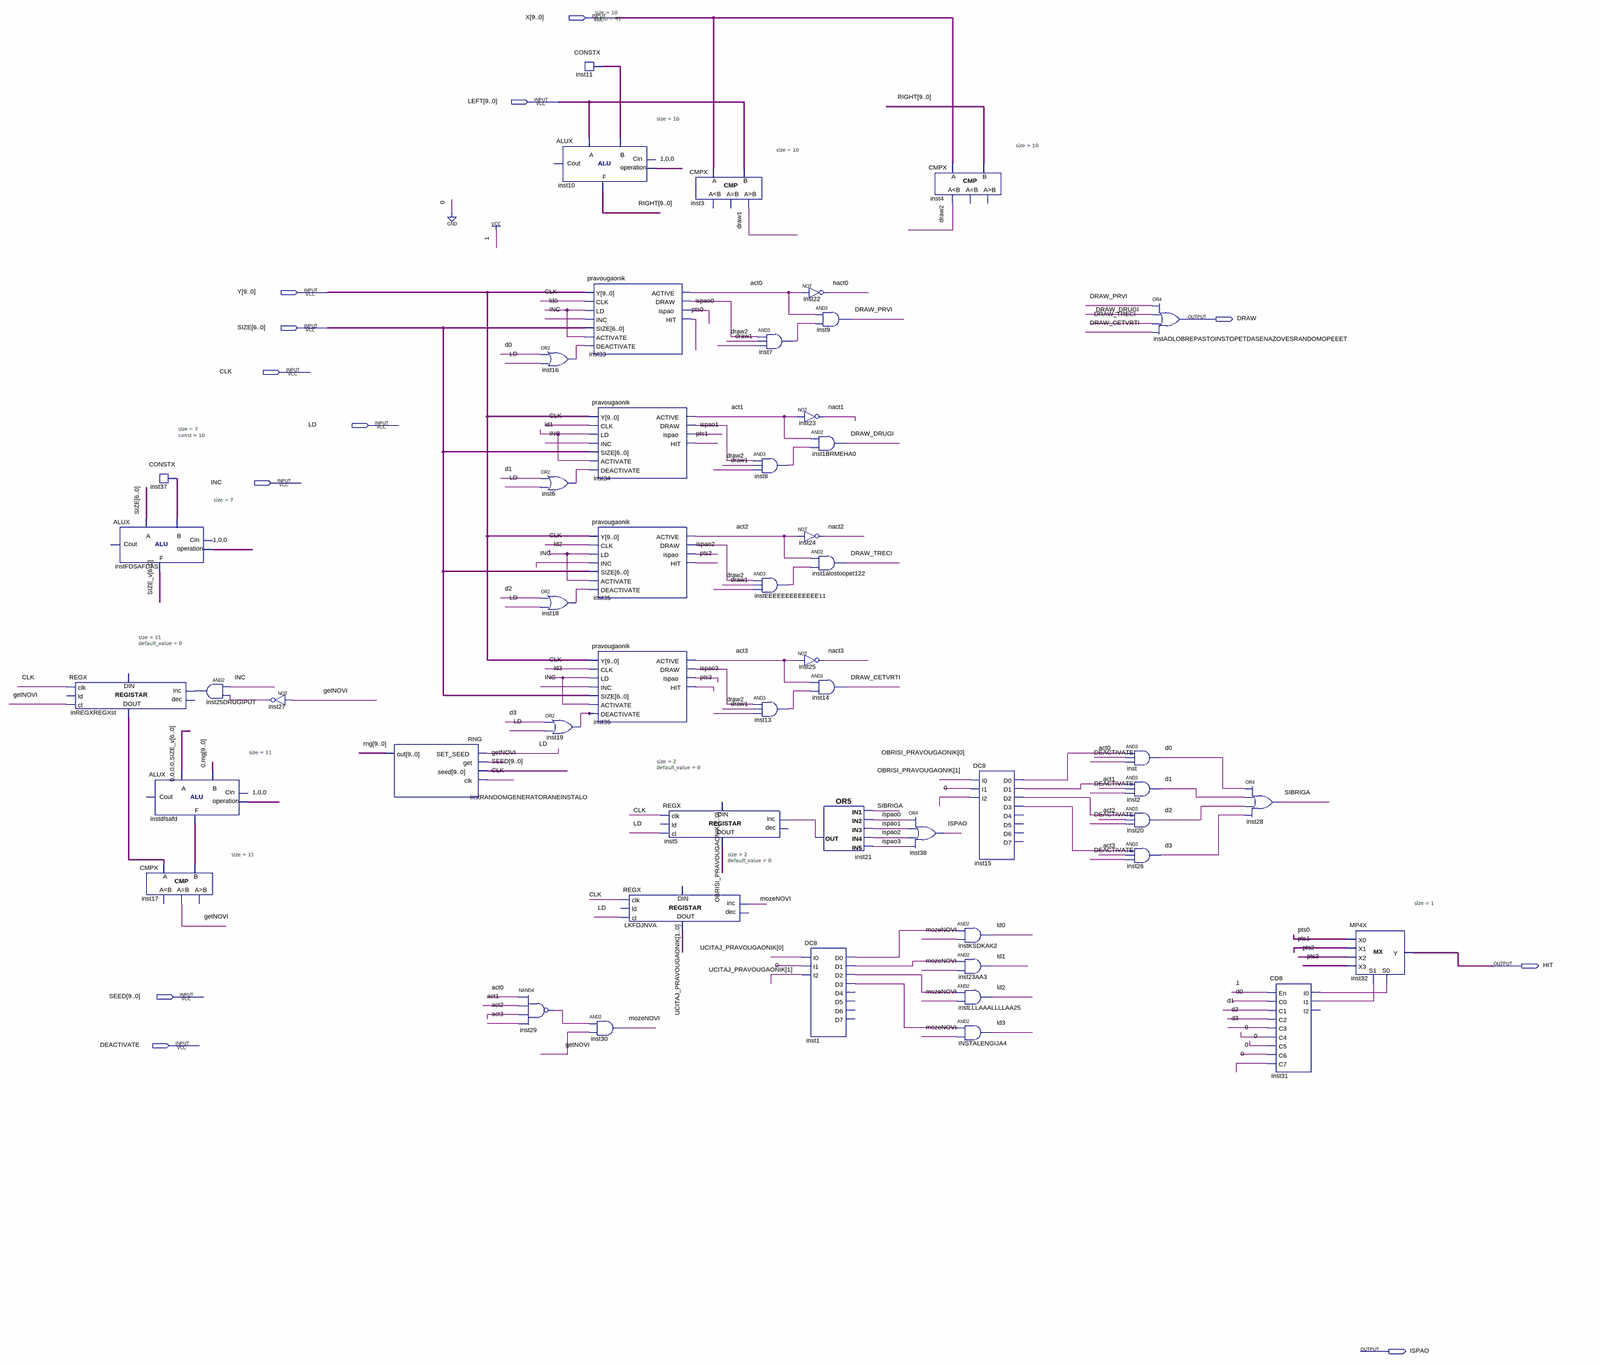
[diagram p0: schematic sheet, whole]
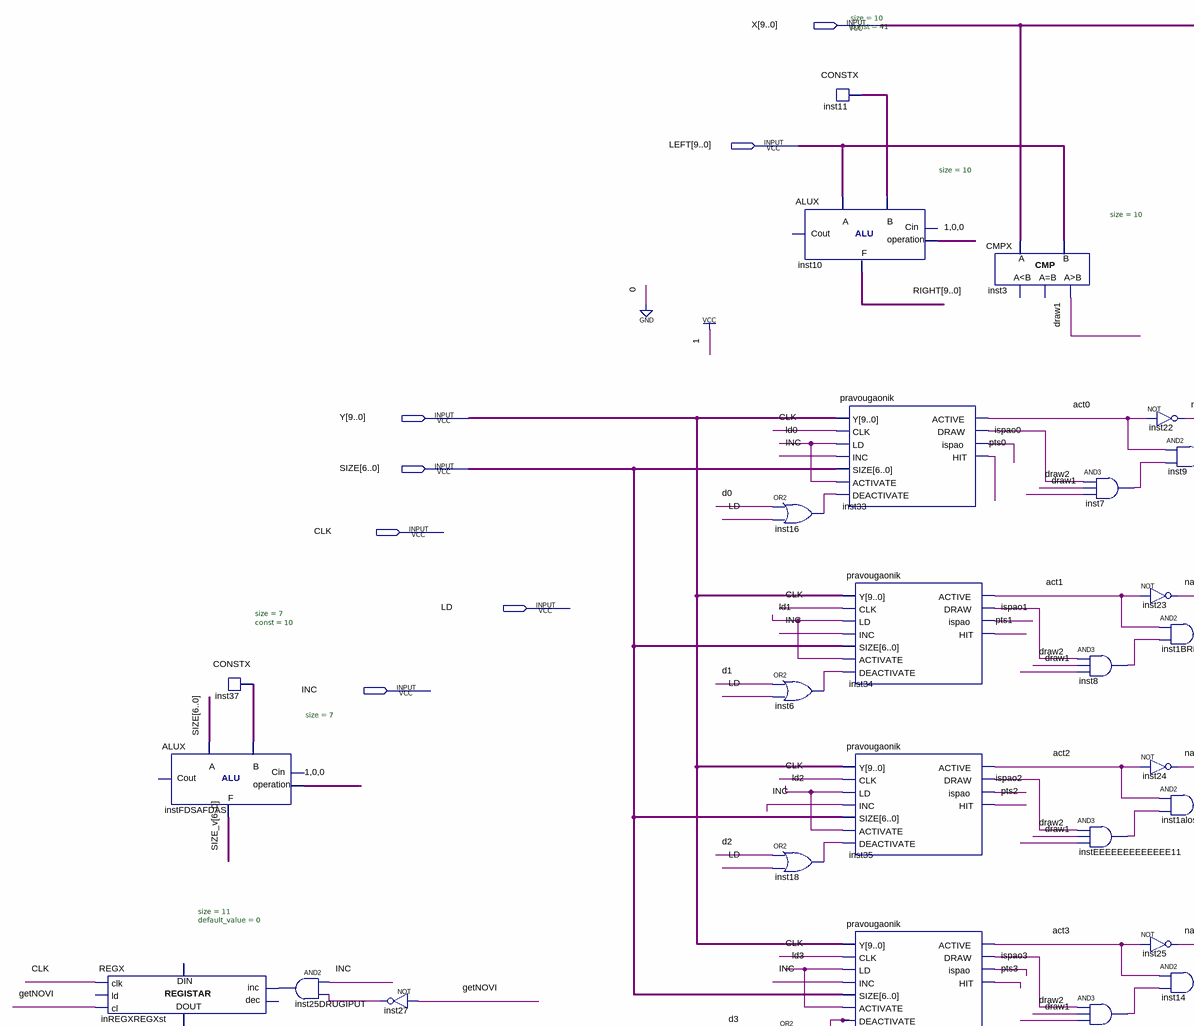
[diagram p1: schematic sheet, upper left part]
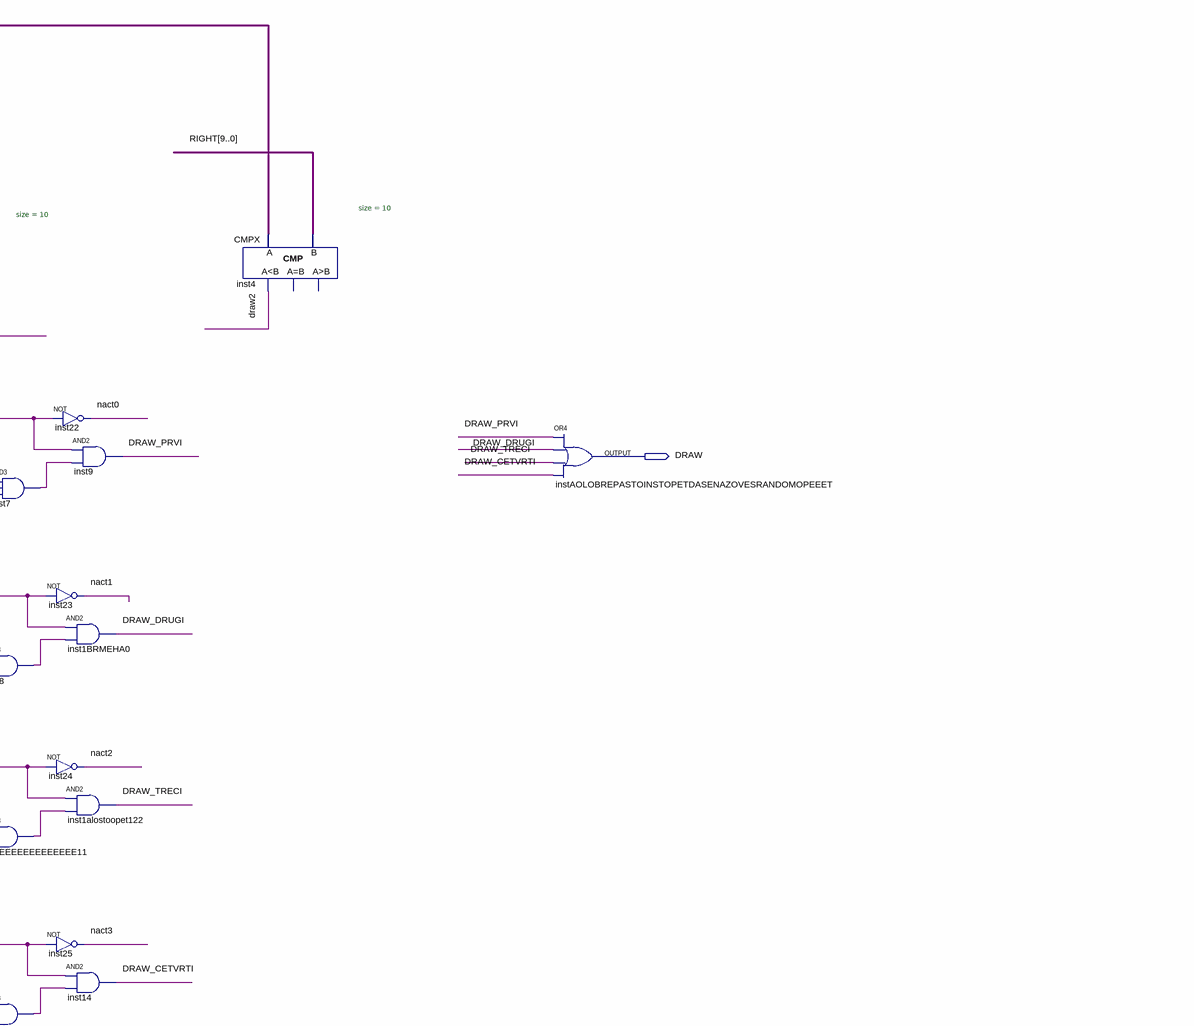
[diagram p2: schematic sheet, upper right part]
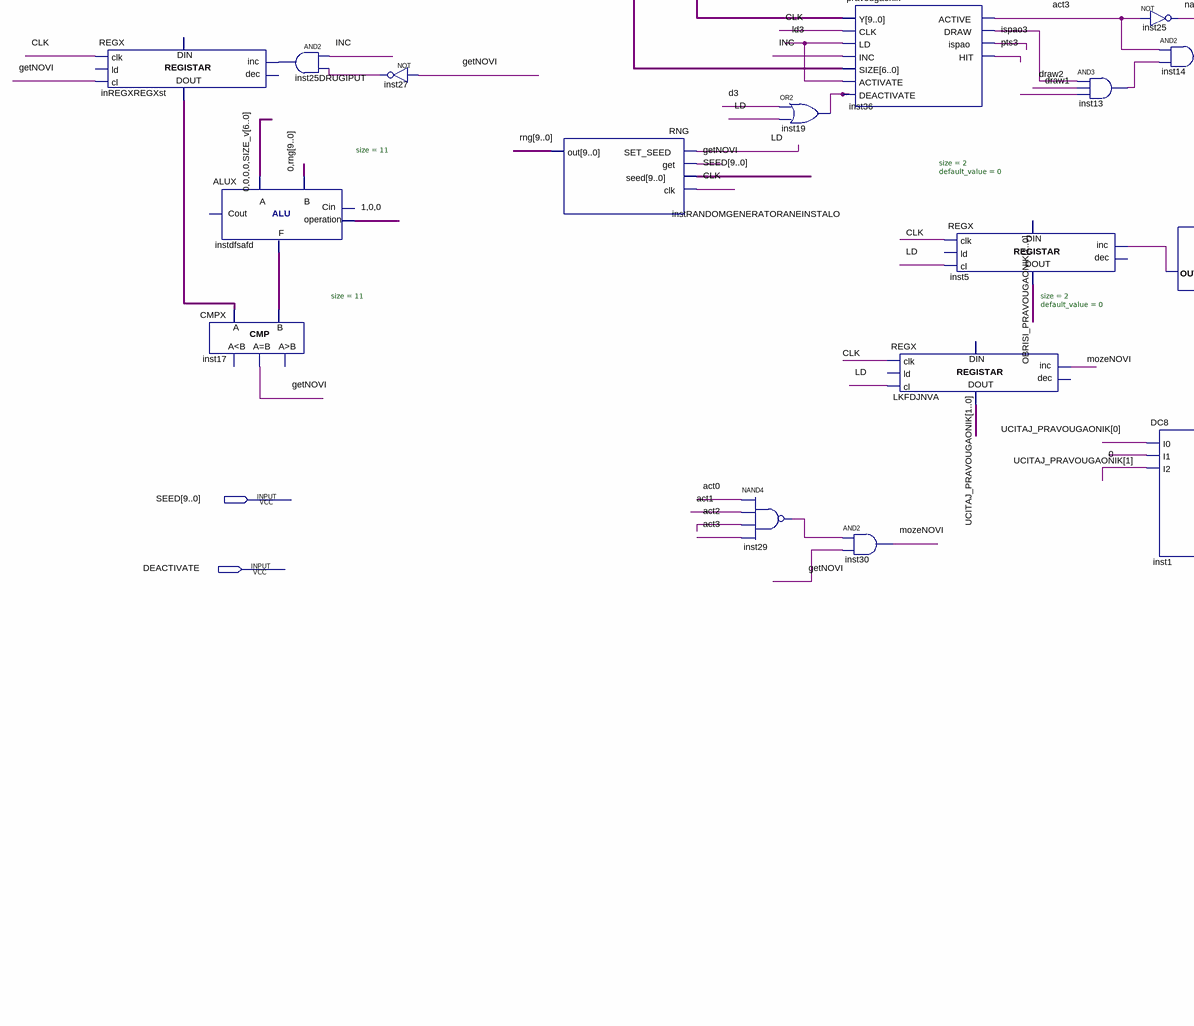
[diagram p3: schematic sheet, lower left part]
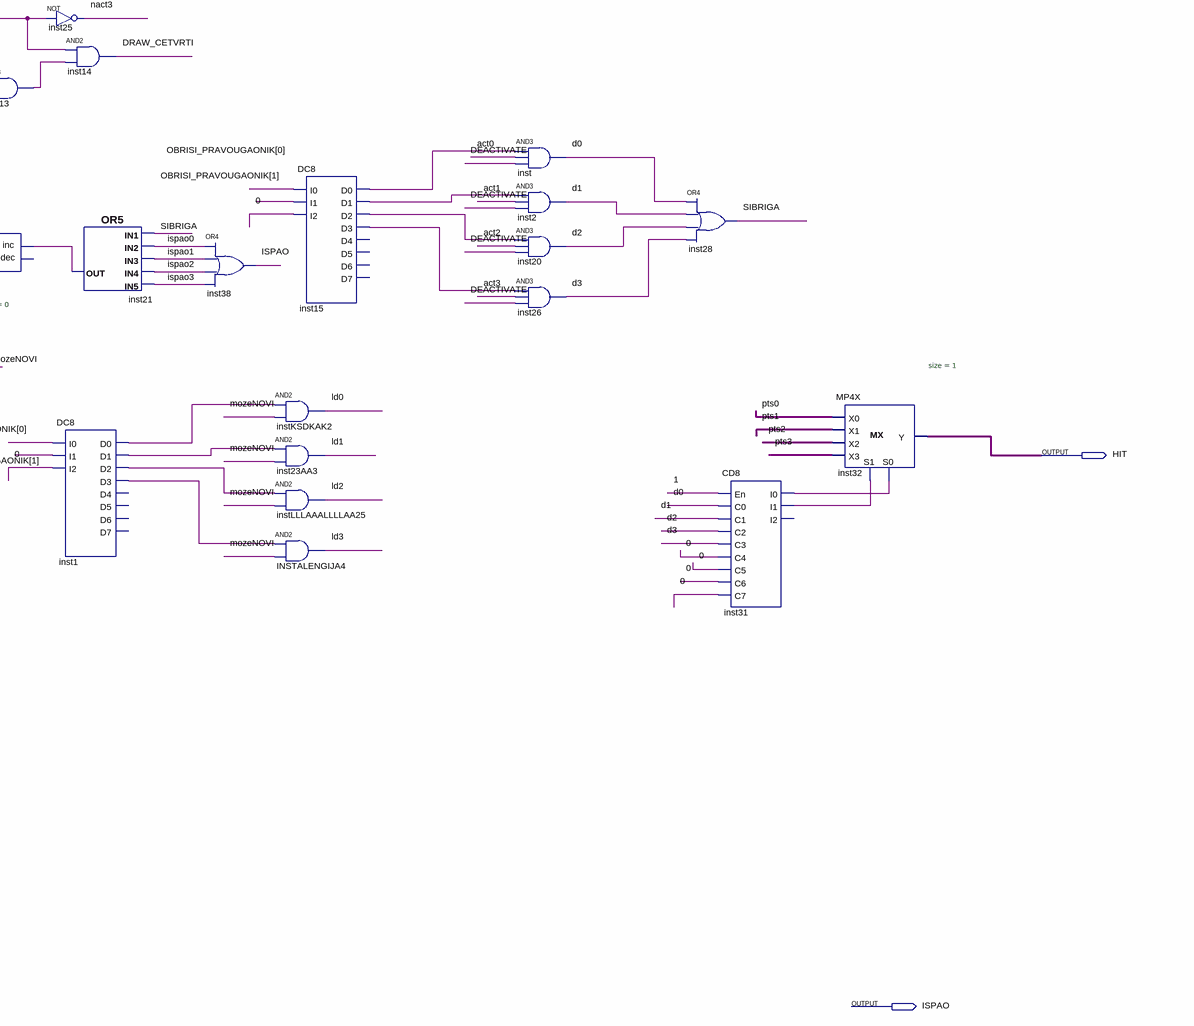
[diagram p4: schematic sheet, lower right part]
// Quartus schematic pravougaonik4_linija.bdf as structural Verilog: 52 symbols, 12 pins
module pravougaonik4_linija (
  input  [9:0] X,
  input  [9:0] LEFT,
  input  [9:0] Y,
  input  [6:0] SIZE,
  input  CLK,
  input  LD,
  input  INC,
  input  [9:0] SEED,
  input  DEACTIVATE,
  output DRAW,
  output HIT,
  output ISPAO
);

  wire act0, act1, act2, act3, d0, d1, d2, d3, draw1, draw2, DRAW_CETVRTI, DRAW_DRUGI, DRAW_PRVI, DRAW_TRECI,
       getNOVI, inst1_d0, inst1_d1, inst1_d2, inst1_d3, inst6_out, inst7_out, inst8_out, inst13_out,
       inst15_d0, inst15_d1, inst15_d2, inst15_d3, inst16_out, inst18_out, inst19_out, inst21_out,
       inst25DRUGIPUT_out, inst27_out, inst29_out, inst31_i0, inst31_i1, inst33_draw, inst34_draw,
       inst35_draw, inst36_draw, instEEEEEEEEEEEEE11_out, ispao0, ispao1, ispao2, ispao3, ld0, ld1, ld2, ld3,
       mozeNOVI, nact0, nact1, nact2, nact3, pts0, pts1, pts2, pts3, SIBRIGA;
  wire [1:0] OBRISI_PRAVOUGAONIK, UCITAJ_PRAVOUGAONIK;
  wire [6:0] inst37_data, SIZE_v;
  wire [9:0] inst11_data, RIGHT, rng;
  wire [10:0] inREGXREGXst_data_out, instdfsafd_f;

  REGX #(.size(11), .default_value(0)) inREGXREGXst (
    .clk(CLK), .cl(getNOVI), .inc(inst25DRUGIPUT_out), .data_out(inREGXREGXst_data_out));  // open: ld, dec, data_in
  ALUX #(.size(7)) instFDSAFDAS (.B(inst37_data), .A(SIZE), .op(3'b100), .F(SIZE_v));  // open: Cin, Cout
  CMPX #(.size(11)) inst17 (.A(inREGXREGXst_data_out), .B(instdfsafd_f), .eq(getNOVI));  // open: ls, gr
  CONSTX #(.size(7), .\const (10)) inst37 (.data(inst37_data));
  ALUX #(.size(11)) instdfsafd (
    .B({1'b0, rng}), .A({4'b0000, SIZE_v}), .op(3'b100), .F(instdfsafd_f));  // open: Cin, Cout
  and inst25DRUGIPUT (inst25DRUGIPUT_out, INC, inst27_out);
  not inst27 (inst27_out, getNOVI);
  RNG instRANDOMGENERATORANEINSTALO (.SET_SEED(LD), .get(getNOVI), .seed(SEED), .clk(CLK), .out(rng));
  nand inst29 (inst29_out, act0, act1, act2, act3);
  ALUX #(.size(10)) inst10 (.B(inst11_data), .A(LEFT), .op(3'b100), .F(RIGHT));  // open: Cin, Cout
  or inst16 (inst16_out, d0, LD);
  or inst6 (inst6_out, d1, LD);
  or inst18 (inst18_out, d2, LD);
  or inst19 (inst19_out, d3, LD);
  CONSTX #(.size(10), .\const (41)) inst11 (.data(inst11_data));
  pravougaonik inst33 (
    .Y(Y), .CLK(CLK), .LD(ld0), .INC(INC), .SIZE(SIZE), .ACTIVATE(ld0), .DEACTIVATE(inst16_out),
    .ACTIVE(act0), .DRAW(inst33_draw), .ispao(ispao0), .HIT(pts0));
  pravougaonik inst34 (
    .Y(Y), .CLK(CLK), .LD(ld1), .INC(INC), .SIZE(SIZE), .ACTIVATE(ld1), .DEACTIVATE(inst6_out),
    .ACTIVE(act1), .DRAW(inst34_draw), .ispao(ispao1), .HIT(pts1));
  pravougaonik inst35 (
    .Y(Y), .CLK(CLK), .LD(ld2), .INC(INC), .SIZE(SIZE), .ACTIVATE(ld2), .DEACTIVATE(inst18_out),
    .ACTIVE(act2), .DRAW(inst35_draw), .ispao(ispao2), .HIT(pts2));
  pravougaonik inst36 (
    .Y(Y), .CLK(CLK), .LD(ld3), .INC(INC), .SIZE(SIZE), .ACTIVATE(ld3), .DEACTIVATE(inst19_out),
    .ACTIVE(act3), .DRAW(inst36_draw), .ispao(ispao3), .HIT(pts3));
  and inst30 (mozeNOVI, inst29_out, getNOVI);
  REGX #(.size(2), .default_value(0)) LKFDJNVA (
    .clk(CLK), .cl(LD), .inc(mozeNOVI), .data_out(UCITAJ_PRAVOUGAONIK));  // open: ld, dec, data_in
  REGX #(.size(2), .default_value(0)) inst5 (
    .clk(CLK), .cl(LD), .inc(inst21_out), .data_out(OBRISI_PRAVOUGAONIK));  // open: ld, dec, data_in
  CMPX #(.size(10)) inst3 (.A(X), .B(LEFT), .gr(draw1));  // open: ls, eq
  and inst7 (inst7_out, inst33_draw, draw2, draw1);
  and inst8 (inst8_out, inst34_draw, draw2, draw1);
  and instEEEEEEEEEEEEE11 (instEEEEEEEEEEEEE11_out, inst35_draw, draw2, draw1);
  and inst13 (inst13_out, inst36_draw, draw2, draw1);
  not inst22 (nact0, act0);
  and inst9 (DRAW_PRVI, act0, inst7_out);
  not inst23 (nact1, act1);
  and inst1BRMEHA0 (DRAW_DRUGI, act1, inst8_out);
  not inst24 (nact2, act2);
  and inst1alostoopet122 (DRAW_TRECI, act2, instEEEEEEEEEEEEE11_out);
  not inst25 (nact3, act3);
  and inst14 (DRAW_CETVRTI, act3, inst13_out);
  or inst21 (inst21_out, SIBRIGA, ispao0, ispao1, ispao2, ispao3);
  DC8 inst1 (
    .I0(UCITAJ_PRAVOUGAONIK[0]), .I1(UCITAJ_PRAVOUGAONIK[1]), .I2(1'b0), .D0(inst1_d0), .D1(inst1_d1),
    .D2(inst1_d2), .D3(inst1_d3));  // open: D4, D5, D6, D7
  or inst38 (ISPAO, ispao0, ispao1, ispao2, ispao3);
  CMPX #(.size(10)) inst4 (.A(X), .B(RIGHT), .ls(draw2));  // open: eq, gr
  and instKSDKAK2 (ld0, inst1_d0, mozeNOVI);
  and inst23AA3 (ld1, inst1_d1, mozeNOVI);
  and instLLLAAALLLLAA25 (ld2, inst1_d2, mozeNOVI);
  and INSTALENGIJA4 (ld3, inst1_d3, mozeNOVI);
  DC8 inst15 (
    .I0(OBRISI_PRAVOUGAONIK[0]), .I1(OBRISI_PRAVOUGAONIK[1]), .I2(1'b0), .D0(inst15_d0), .D1(inst15_d1),
    .D2(inst15_d2), .D3(inst15_d3));  // open: D4, D5, D6, D7
  and inst (d0, inst15_d0, act0, DEACTIVATE);
  and inst2 (d1, inst15_d1, act1, DEACTIVATE);
  and inst20 (d2, inst15_d2, act2, DEACTIVATE);
  and inst26 (d3, inst15_d3, act3, DEACTIVATE);
  or instAOLOBREPASTOINSTOPETDASENAZOVESRANDOMOPEEET (DRAW, DRAW_PRVI, DRAW_DRUGI, DRAW_TRECI, DRAW_CETVRTI);
  or inst28 (SIBRIGA, d0, d1, d2, d3);
  CD8 inst31 (
    .En(1'b1), .C0(d0), .C1(d1), .C2(d2), .C3(d3), .C4(1'b0), .C5(1'b0), .C6(1'b0), .C7(1'b0),
    .I0(inst31_i0), .I1(inst31_i1));  // open: I2
  MP4X #(.size(1)) inst32 (.S0(inst31_i0), .S1(inst31_i1), .X0(pts0), .X1(pts1), .X2(pts2), .X3(pts3), .Y(HIT));
endmodule
